# Altium schematic sheet Channel.SchDoc
size A
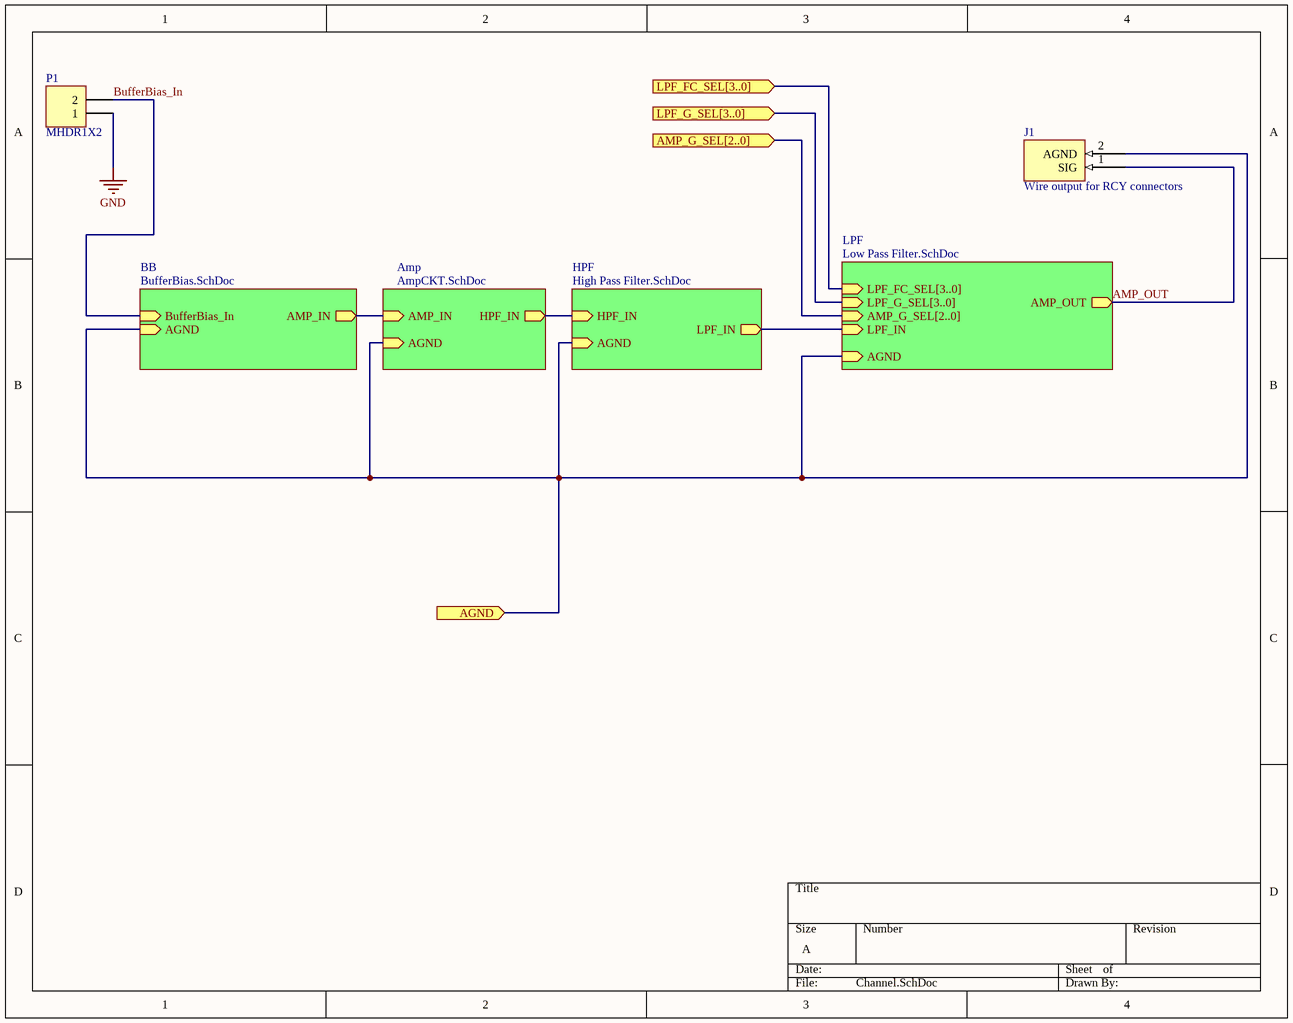
[diagram p0: Channel.SchDoc]

## Parts
J1  Wire output for RCY connectors  [WireOut]
P1  MHDR1X2  [MHDR1X2]

## Sub-sheets
Amp = AmpCKT.SchDoc: AMP_IN (in), AGND (in), HPF_IN (out)
BB = BufferBias.SchDoc: BufferBias_In (in), AGND (in), AMP_IN (out)
HPF = High Pass Filter.SchDoc: HPF_IN (in), AGND (in), LPF_IN (out)
LPF = Low Pass Filter.SchDoc: LPF_FC_SEL[3..0] (in), LPF_G_SEL[3..0] (in), AMP_G_SEL[2..0] (in), LPF_IN (in), AMP_OUT (out), AGND (in)

## Ports
AGND (in), AMP_G_SEL[2..0] (in), LPF_FC_SEL[3..0] (in), LPF_G_SEL[3..0] (in)

## Nets
GND: P1.1
AGND: J1.2(AGND) ; port AGND, sheet LPF/AGND, sheet HPF/AGND, sheet BB/AGND, sheet Amp/AGND
AMP_OUT: J1.1(SIG) ; sheet LPF/AMP_OUT
BufferBias_In: P1.2 ; sheet BB/BufferBias_In
(unnamed): sheet LPF/LPF_IN, sheet HPF/LPF_IN
(unnamed): sheet HPF/HPF_IN, sheet Amp/HPF_IN
(unnamed): sheet BB/AMP_IN, sheet Amp/AMP_IN

## Buses and harness runs
bus port AMP_G_SEL[2..0] = sheet LPF/AMP_G_SEL[2..0]
bus port LPF_FC_SEL[3..0] = sheet LPF/LPF_FC_SEL[3..0]
bus port LPF_G_SEL[3..0] = sheet LPF/LPF_G_SEL[3..0]

## Library data of the parts
J1 = WireOut: Manufacturer: JST Sales America Inc.; Manufacturer Part Number: SYP-02T-1; Descriptions: 2 Rectangular Connectors - Housings Plug Red 0.098" (2.50mm); Value: N/A; Package / Case: N/A Through Hole; Datasheet Link: https://www.jst-mfg.com/product/pdf/eng/eRCY.pdf
P1 = MHDR1X2: Value: N/A; Package / Case: MHDR1X2